# Altium schematic sheet MCP3909.SchDoc
size A4
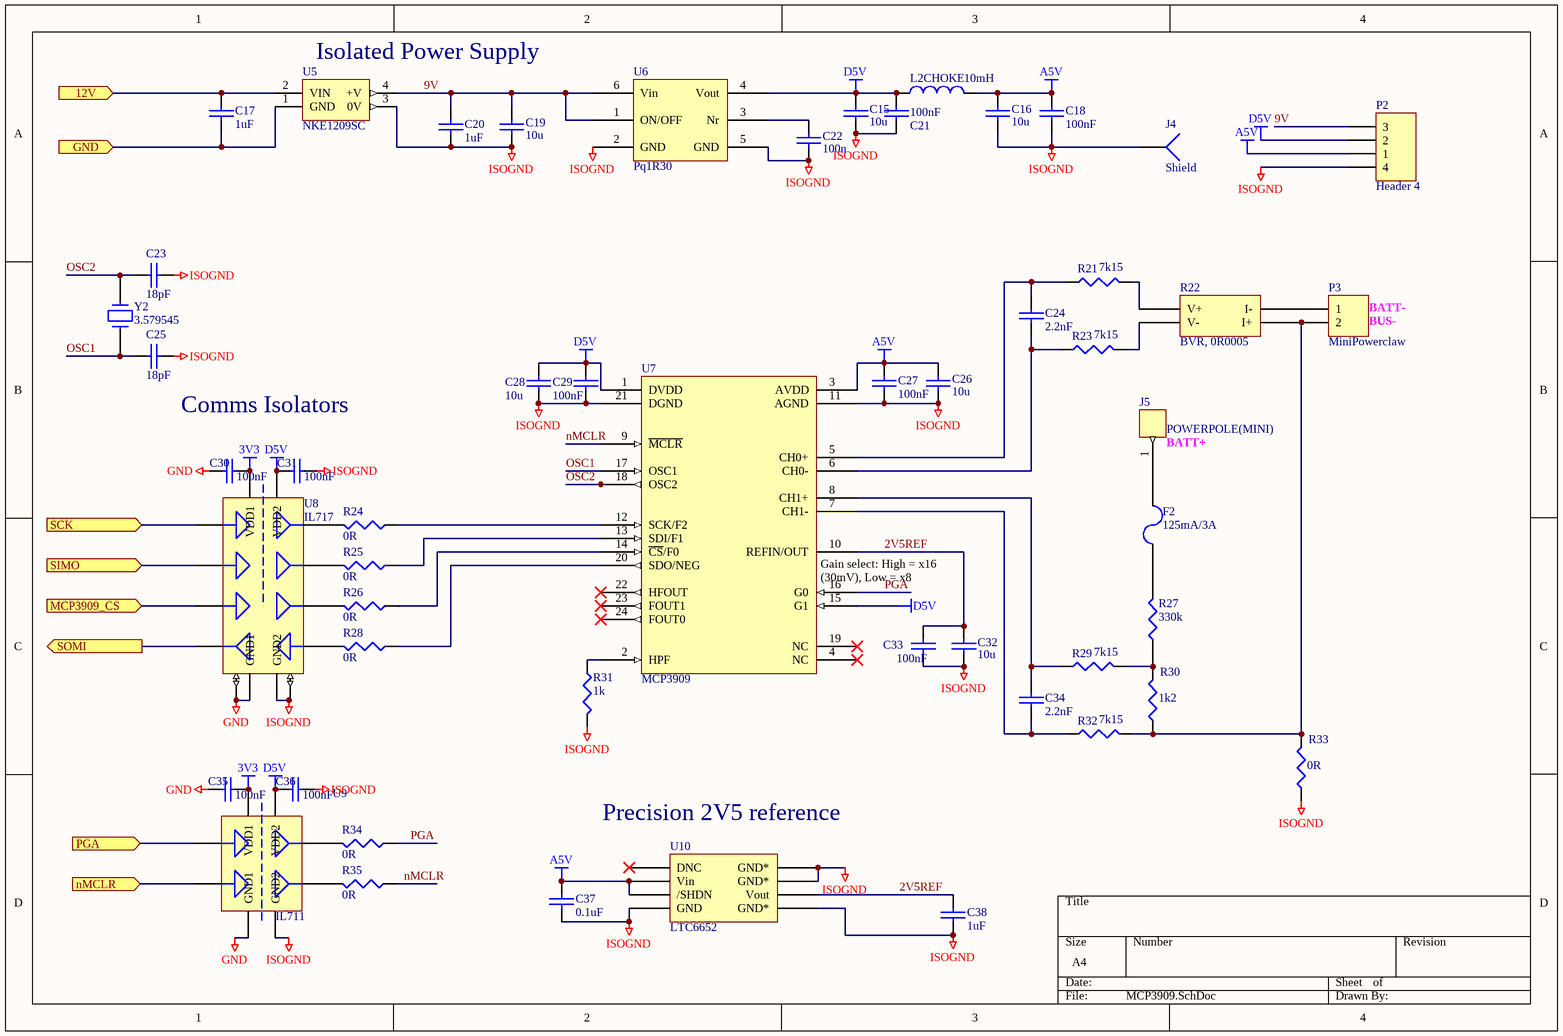
[diagram p0: MCP3909.SchDoc]

## Parts
C15  10u  [0805]
C16  10u  [0805]
C17  1uF  [0805]
C18  100nF  [0603]
C19  10u  [0805]
C20  1uF  [0805]
C21  100nF  [0603]
C22  100n  [0603]
C23  18pF  [0603]
C24  2.2nF  [0603]
C25  18pF  [0603]
C26  10u  [0805]
C27  100nF  [0603]
C28  10u  [0805]
C29  100nF  [0603]
C30  100nF  [0603]
C31  100nF  [0603]
C32  10u  [0805]
C33  100nF  [0603]
C34  2.2nF  [0603]
C35  100nF  [0603]
C36  100nF  [0603]
C37  0.1uF  [0805]
C38  1uF  [0805]
F2  125mA/3A  [LITTELFUSE-154-250V]
J4  Shield  [BMIS-203-SHIELD]
J5  POWERPOLE(MINI)  [POWERPOLE25A]
L2  CHOKE  value 10mH  [1812]
P2  Header 4  [HDR1X4]
P3  MiniPowerclaw  [MiniPowerpole-Hrz]
R21  7k15  [0603]
R22  BVR, 0R0005  [BVR]
R23  7k15  [0603]
R24  0R  [0603]
R25  0R  [0603]
R26  0R  [0603]
R27  330k  [1206]
R28  0R  [0603]
R29  7k15  [0603]
R30  1k2  [1206]
R31  1k  [0603]
R32  7k15  [0603]
R33  0R  [1206]
R34  0R  [0603]
R35  0R  [0603]
U5  NKE1209SC  [NPSIP4]
U6  Pq1R30  [SOT23-6]
U7  MCP3909  [SOP24-wide]
U8  IL717  [SO16]
U9  IL711  [SO8]
U10  LTC6652  [SOP8 - duplicate]
Y2  3.579545  [HC49/4H]

## Ports
12V (in), GND, MCP3909_CS (in), nMCLR (in), PGA (in), SCK (in), SIMO (in), SOMI (out)

## Nets
3V3: C30.2 C35.2 U8.1(VDD1) U9.1(VDD1)
A5V: C16.2 C18.1 C26.2 C27.1 C37.1 L2.2 P2.1 U7.3(AVDD) U10.2(Vin) U10.3(/SHDN)
D5V: C15.2 C21.1 C28.2 C29.2 C31.2 C36.2 L2.1 P2.2 U6.4(Vout) U7.1(DVDD) U7.15(G1) U8.16(VDD2) U9.8(VDD2)
GND: C30.1 C35.1 U8.2(GND1) U8.8(GND1) U9.4(GND1)
ISOGND: C15.1 C16.1 C18.2 C19.1 C20.2 C21.2 C22.1 C23.2 C25.2 C26.1 C27.2 C28.1 C29.1 C31.1 C32.1 C33.2 C36.1 C37.2 C38.1 J4.1 P2.4 R31.2 R33.1 U5.3(0V) U6.2(GND) U6.5(GND) U7.11(AGND) U7.21(DGND) U8.9(GND2) U8.15(GND2) U9.5(GND2) U10.4(GND) U10.5(GND*) U10.7(GND*) U10.8(GND*)
2V5REF: C32.2 C33.1 C38.2 U7.10(REFIN/OUT) U10.6(Vout)
9V: C19.2 C20.1 P2.3 U5.4(+V) U6.1(ON/OFF) U6.6(Vin)
12V: C17.1 U5.2(VIN) ; port 12V
GND: C17.2 U5.1(GND) ; port GND  [a separate net that carries the same name]
MCP3909_CS: U8.5(IN3) ; port MCP3909_CS
nMCLR: R35.1 U7.9(~{MCLR})
nMCLR: U9.3(IN2) ; port nMCLR  [a separate net that carries the same name]
OSC1: C25.1 U7.17(OSC1) Y2.1
OSC2: C23.1 U7.18(OSC2) Y2.2
PGA: R34.1 U7.16(G0)
PGA: U9.2(IN1) ; port PGA  [a separate net that carries the same name]
SCK: U8.3(IN1) ; port SCK
SIMO: U8.4(IN2) ; port SIMO
SOMI: U8.6(OUT4) ; port SOMI
NetC22_2: C22.2 U6.3(Nr)
NetC24_1: C24.1 R23.1 U7.6(CH0-)
NetC24_2: C24.2 R21.1 U7.5(CH0+)
NetC34_1: C34.1 R29.1 U7.8(CH1+)
NetC34_2: C34.2 R32.1 U7.7(CH1-)
NetF2_1: F2.1 R27.2
NetF2_2: F2.2 J5.1
NetP3_1: P3.1 R22.3(I-)
NetP3_2: P3.2 R22.4(I+) R30.1 R32.2 R33.2
NetR21_2: R21.2 R22.1(V+)
NetR22_2: R22.2(V-) R23.2
NetR24_1: R24.1 U7.12(SCK/F2)
NetR24_2: R24.2 U8.14(OUT1)
NetR25_1: R25.1 U7.13(SDI/F1)
NetR25_2: R25.2 U8.13(OUT2)
NetR26_1: R26.1 U7.14(~{CS}/F0)
NetR26_2: R26.2 U8.12(OUT3)
NetR27_1: R27.1 R29.2 R30.2
NetR28_1: R28.1 U7.20(SDO/NEG)
NetR28_2: R28.2 U8.11(IN4)
NetR31_1: R31.1 U7.2(HPF)
NetR34_2: R34.2 U9.7(OUT1)
NetR35_2: R35.2 U9.6(OUT2)

Not connected (* = marked no-connect by the designer): U7 4(NC)* 19(NC)* 22(HFOUT)* 23(FOUT1)* 24(FOUT0)*; U10 1(DNC)*

## Notes on the sheet
- (near U5) Isolated Power Supply
- (near P3) BATT-
- (near P3) BUS-
- Comms Isolators
- (near J5) BATT+
- (near U7) Gain select: High = x16 (30mV), Low = x8 (60mV)
- (near U10) Precision 2V5 reference

## Library data of the parts
C15 C16 C19 C22 C26 C28 C32 = CAP: Capacitor; Order#: 521-2820; Price: 0.489; Supplier: Farnell
C17 C20 C37 C38 = CAP: Capacitor; Order#: ??; Price: ??; Supplier: ??
C18 C21 C27 C29-C31 C33 C35 C36 = CAP: Capacitor; Order#: 753-567; Price: 0.31; Supplier: Farnell
C23 C25 = CAP: Capacitor; Order#: 721-992; Price: 0.11; Supplier: Farnell
C24 C34 = CAP: Capacitor; Order#: 498-592; Price: 0.128; Supplier: Farnell
F2 = FUSE2: Fuse; Order#: 994-3609; Other Info: www.littelfuse.com; Price: 7.78; Supplier: Farnell
J4 = Socket: LatestRevisionDate: 17-Jul-2002; LatestRevisionNote: Re-released for DXP Platform.; Publisher: Altium Limited
J5 = CON1: RS: 534-979 + 534-963; Farnell: -; Digikey: -
L2 = INDUCTOR: Manufacturer: Generic Components; Class I: Passive; Published: 8-Jun-2000; Revision: July-2002: Re-released for DXP Platform.; Publisher: Altium Limited; Class II: Inductor
P2 = Header 4: Header, 4-Pin; LatestRevisionDate: 17-Jul-2002; LatestRevisionNote: Re-released for DXP Platform.; Publisher: Altium Limited
P3 = Header 2: Header, 2-Pin; pin to pad: 1>2 2>1; LatestRevisionDate: 17-Jul-2002; LatestRevisionNote: Re-released for DXP Platform.; Publisher: Altium Limited
R21 R23 R29 R31 R32 = RES1: Resistor; Order#: 933-1697; Price: 0.11; Supplier: Farnell
R22 = BVR
R24-R26 R28 R34 R35 = RES1: Resistor; Order#: 9233253; Supplier: Farnell; Price: 0.088
R27 = RES1: Order#: 308-9587; Price: 1.160; Supplier: Farnell
R30 R33 = RES1: Resistor; Value: 0.002; Order#: BVS-A-R002; Supplier: Isotek (http://www.isotekcorp.com); Price: 1.12USD
U5 = LME1209S: Isolated 250mW Single Output; RS: 689-5034
U7 = MCP3909: Energy Measurement IC; Order#: MCP3909-I/SS-ND; Price: 2.8800; Supplier: Digikey
U8 = IL717: Isoloop IL717 - www.nve.com; Order#: 957-0659; Price: 19.20; Supplier: Farnell
U9 = IL711: IL711 Optical Isolator; Order#: 1314985; Price: 9.97; Supplier: Farnell
Y2 = CRYSTAL: Order#: 971-2895; Price: 3.98; Supplier: Farnell
U10 = LTC6652: Farnell: 1556273